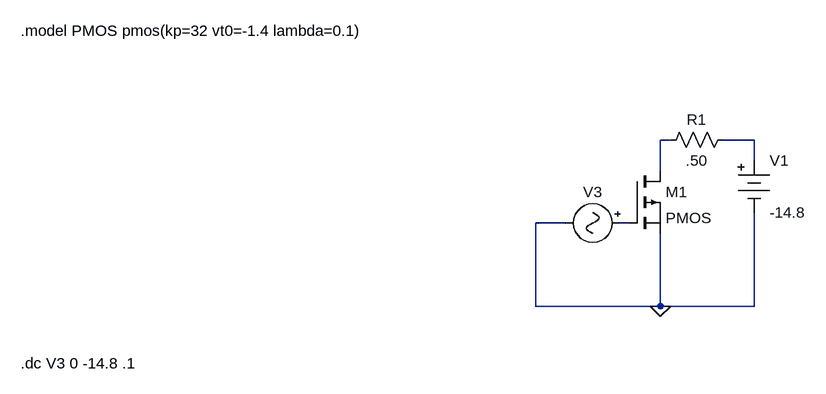
[diagram p0: schematic IRFZ34Mosfet_simulation.asc]
IRFZ34Mosfet_simulation.asc, the LTspice schematic file:
Version 4
SHEET 1 880 680
WIRE 160 64 144 64
WIRE 288 64 240 64
WIRE 288 96 288 64
WIRE 144 112 144 64
WIRE 0 192 -48 192
WIRE 96 192 80 192
WIRE -48 320 -48 192
WIRE 144 320 144 208
WIRE 144 320 -48 320
WIRE 288 320 288 176
WIRE 288 320 144 320
FLAG 144 320 0
SYMBOL Misc\\signal 96 192 R90
WINDOW 0 -32 56 VBottom 2
WINDOW 3 32 56 VTop 2
WINDOW 123 0 0 Left 0
WINDOW 39 0 0 Left 0
SYMATTR InstName V3
SYMATTR Value ""
SYMBOL pmos 96 112 R0
SYMATTR InstName M1
SYMBOL res 256 48 R90
WINDOW 0 0 56 VBottom 2
WINDOW 3 32 56 VTop 2
SYMATTR InstName R1
SYMATTR Value .50
SYMBOL Misc\\battery 288 80 R0
SYMATTR InstName V1
SYMATTR Value -14.8
TEXT -840 -104 Left 2 !.model PMOS pmos(kp=32 vt0=-1.4 lambda=0.1)
TEXT -840 408 Left 2 !.dc V3 0 -14.8 .1

The netlist it stands for:
* IRFZ34Mosfet_simulation.asc
V3 N003 0
M1 N001 N003 0 0 PMOS
R1 N002 N001 .50
V1 N002 0 -14.8
.model NMOS NMOS
.model PMOS PMOS
.lib standard.mos
.model PMOS pmos(kp=32 vt0=-1.4 lambda=0.1)
.dc V3 0 -14.8 .1
.backanno
.end

* Results of the author's LTspice run, read from the files saved beside the schematic
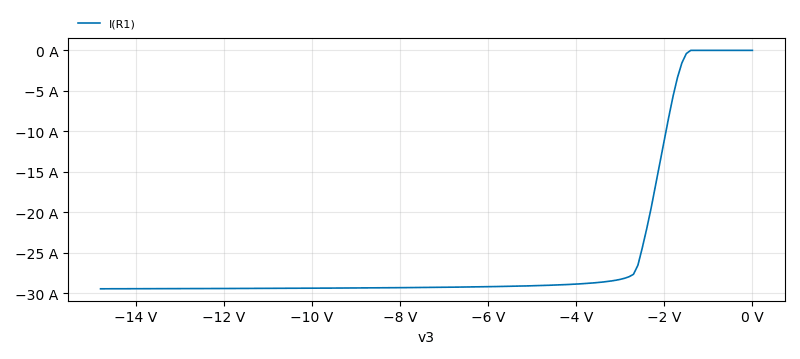
[diagram p1: DC transfer characteristic of IRFZ34Mosfet_simulation.asc, plotted from the saved traces]
* DC transfer characteristic, 1 run:
*   I(R1): -29.61 pA at v3=0 V, -29.46 A at v3=-14.8 V, min -29.46 A, max -29.61 pA